# EAGLE design Adafruit STEMMA QT Booster Breakout (EAGLE 9.6.2)
COMPANY: ADAFRUIT INDUSTRIES; DRAWN: KTOWN; REV: A
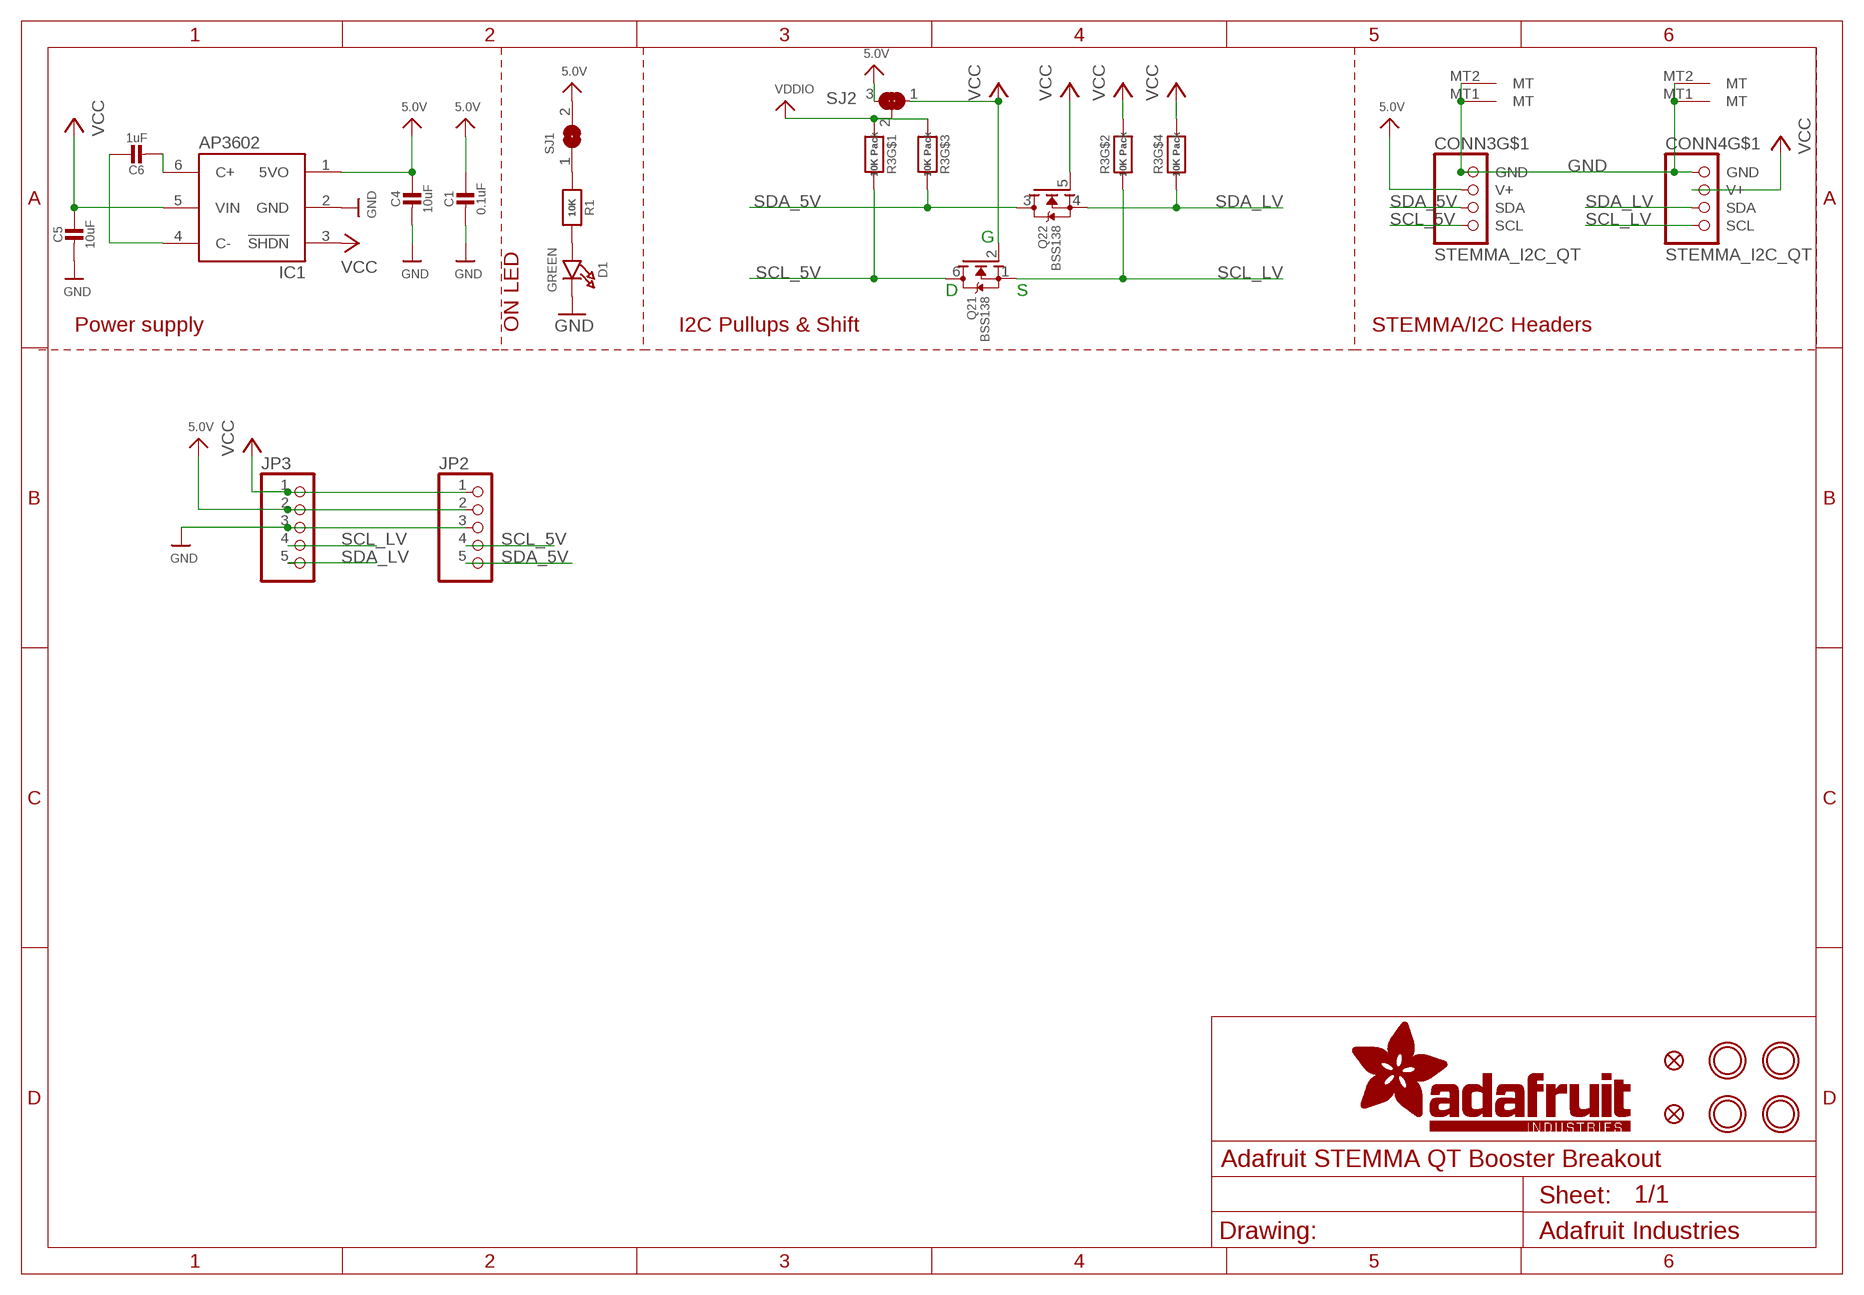
[diagram p0: schematic, sheet 1]

## Parts
C1  0.1uF  CAP_CERAMIC0603_NO  [0603-NO]
C4  10uF  CAP_CERAMIC0805-NOOUTLINE  [0805-NO]
C5  10uF  CAP_CERAMIC0805-NOOUTLINE  [0805-NO]
C6  1uF  CAP_CERAMIC0805-NOOUTLINE  [0805-NO]
CONN3  STEMMA_I2C_QT  [JST_SH4]
CONN4  STEMMA_I2C_QT  [JST_SH4]
D1  GREEN  LED0603_NOOUTLINE  [CHIPLED_0603_NOOUTLINE]
FID3  FIDUCIAL_1MM  [FIDUCIAL_1MM]
FID4  FIDUCIAL_1MM  [FIDUCIAL_1MM]
IC1  AP3602/RT9361  AP3602  [SOT23-6]
JP2  HEADER-1X576MIL  [1X05_ROUND_76]
JP3  HEADER-1X576MIL  [1X05_ROUND_76]
Q2  BSS138  MOSFET-N_DUAL  [SOT363]
R1  10K  RESISTOR_0603_NOOUT  [0603-NO]
R3  10K Pack  RESISTOR_4PACK  [RESPACK_4X0603]
SJ1  SOLDERJUMPERCLOSED  [SOLDERJUMPER_CLOSEDWIRE]
SJ2  SOLDERJUMPER_2WAY  [SOLDERJUMPER_2WAY_OPEN_NOPASTE]
U$1  MOUNTINGHOLE2.5  [MOUNTINGHOLE_2.5_PLATED]
U$17  MOUNTINGHOLE2.5  [MOUNTINGHOLE_2.5_PLATED]
U$19  MOUNTINGHOLE2.5  [MOUNTINGHOLE_2.5_PLATED]
U$21  MOUNTINGHOLE2.5  [MOUNTINGHOLE_2.5_PLATED]

## Nets
5.0V: C1.1 C4.1 CONN3.2(V+) IC1.1(5VO) JP2.2 JP3.2 SJ1.2 SJ2.3
GND [highpower]: C1.2 C4.2 C5.2 CONN3.1(GND) CONN3.MT1(MT) CONN3.MT2(MT) CONN4.1(GND) CONN4.MT1(MT) CONN4.MT2(MT) D1.C IC1.2(GND) JP2.3 JP3.3
N$1: D1.A R1.2
N$2 [lowpower]: R1.1 SJ1.1
N$3: C6.2 IC1.6(C+)
N$4: C6.1 IC1.4(C-)
SCL_5V: CONN3.4(SCL) JP2.4 Q2.6(1:D) R3.8
SCL_LV: CONN4.4(SCL) JP3.4 Q2.1(1:S) R3.7
SDA_5V: CONN3.3(SDA) JP2.5 Q2.3(2:D) R3.6
SDA_LV: CONN4.3(SDA) JP3.5 Q2.4(2:S) R3.5
VCC [highpower]: C5.1 CONN4.2(V+) IC1.3(!SHDN) IC1.5(VIN) JP2.1 JP3.1 Q2.2(1:G) Q2.5(2:G) R3.2 R3.4 SJ2.1
VDDIO: R3.1 R3.3 SJ2.2

## Notes on the sheet
- G
- D | S
- Power supply | ON LED | I2C Pullups & Shift | STEMMA/I2C Headers

## Library data of the parts
C1 C4-C6 = microbuilder:CAP_CERAMIC: Ceramic Capacitors For new designs, use the packages preceded by an '_' character since they are more reliable: The following footprints should be used on most boards: _0402 - Standard footprint for regular board layouts _0603 - Standard footprint for regular board layouts _0805 - Standard footprint for regular board layouts _1206 - Standard footprint for regular board layouts For extremely tight-pitch boards where space is at a premium, the following 'micro-pitch' footprints can be used (smaller pads, no silkscreen outline, etc.): _0402MP - Micro-pitch footprint for very dense/compact boards _0603MP - Micro-pitch footprint for very dense/compact boards _0805MP - Micro-pitch footprint for very dense/compact boards _1206MP - Micro-pitch footprint for very dense/compact boards
CONN3 CONN4 = adafruit_electromech:STEMMA_I2C; LCSC: C2845363
D1 = microbuilder:LED: LED 0603 - 0603 Surface Mount Package 2mA: Green LED - Low Power (3.9mcd, 2ma, 1.7Vf) - Digikey: 475-2709-2-ND Orange LED - Low Power (9.8mcd, 2ma, 1.8Vf) - Digikey: 475-1194-2-ND Red LED - Low Power (5mcd, 2ma, 1.8Vf) - Digikey: 475-1195-2-ND Yellow LED - Low Power (7mcd, 2ma, 1.8Vf) - Digikey: 475-1196-2-ND 5mA: Blue LED - Low Power (17mcd, 5ma, 2.9Vf) - Digikey: LNJ937W8CRACT-ND 0805 - 0805 Surface Mount Package 2mA: Red LED (8.8mcd, 2mA, 1.8Vf, Clear) - Low Power [Digikey: 475-2510-1-ND] Green LED (5mcd, 2mA, 1.8Vf, Clear) - Low Power [Digikey: 475-2730-1-ND] Yellow LED (11.3mcd, 2mA, 1.8Vf, Clear) - Low Power [Digikey: 475-2555-1-ND] 20mA: Red LED (104mcd, 20mA, Diffused) - LS R976 [Digikey: 475-1278-6-ND] Red LED (12mcd, 20mA, 2.0Vf, Clear) - APT2012EC [Digikey: 754-1128-1-ND] Green LED (15mcd, 20mA, 2.2Vf, Clear) - APT2012GC [Digikey: 754-1131-1-ND] Orange LED (160mcd, 20mA, 2.1Vf, Clear) - APT2012SECK [Digikey: 754-1130-1-ND] 1206 - 1206 Surface Mount Package Green LED (26mcd, 20mA, Diffused) - LG N971 [Digikey: 475-1407-6-ND] Red LED (15mcd, 20mA, Diffused) - LH N974 [Digikey: 475-1416-6-ND] Cree - Cree High-Power Surface Mount LEDs XPEBWT-L1-0000-00D50 - White 111lm 350mA 2.9Vf 6200K 110° XTEAWT-00-0000-00000LEE3 - White 114lm 350mA 2.85Vf 5000K 115° Everlight - Everlight 45-21 Series Surface Mount LEDs 45-21/QK2C-B2832AC2CB2/2T - Warm White 2000mcd 20mA 3.25Vf 3050K 120° 45-21/LK2C-B38452C4CB2/2T - Nuetral White 2000mcd 20mA 3.25Vf 4150K 120° 45-21/LK2C-B50634C6CB2/2T - Cold White 2200mcd 20mA 3.25Vf 5650K 120° PLCC2 Reverse Mount LS T77K-J1L2-1-0-2-R18-Z - Red 11.25mcd 2mA 1.8Vf 630nm 120° LO T77K-L1M2-24-Z - Orange 19.6mcd 2mA 1.8Vf 606nm 120° LY T77K-K2M1-26-Z - Yellow 15.7mcd 2mA 1.8Vf 587nm 120°; ROT: 270
FID3 FID4 = microbuilder:FIDUCIAL: Fiducial Alignment Points Various fiducial points for machine vision alignment.; BOM: EXCLUDE
IC1 = microbuilder:AP3602
JP2 JP3 = microbuilder:HEADER-1X5: PIN HEADER
Q2 = microbuilder:MOSFET-N_DUAL: Dual N-Channel MOSFET SOT363 (2.0x1.25mm) 2N7002PS - 60V, 320mA [Digikey: 568-5984-1-ND]; JLC_ROTATION: 270
R1 = microbuilder:RESISTOR: Resistors For new designs, use the packages preceded by an '_' character since they are more reliable: The following footprints should be used on most boards: _0402 - Standard footprint for regular board layouts _0603 - Standard footprint for regular board layouts _0805 - Standard footprint for regular board layouts _1206 - Standard footprint for regular board layouts For extremely tight-pitch boards where space is at a premium, the following 'micro-pitch' footprints can be used (smaller pads, no silkscreen outline, etc.): _0402MP - Micro-pitch footprint for very dense/compact boards _0603MP - Micro-pitch footprint for very dense/compact boards _0805MP - Micro-pitch footprint for very dense/compact boards _1206MP - Micro-pitch footprint for very dense/compact boards
R3 = microbuilder:RESISTOR_4PACK: Resistor Packs (4 resistors) 4 x 0603 10K 1/16W - Digikey: YC164J-10KCT-ND
SJ1 = microbuilder:SOLDERJUMPER: SMD Solder JUMPER Solder the two pads together to create a connection, or remove the solder to break it. REFLOW - Use this footprint for solder paste and reflow ovens. WAVE - Use this footprint for hand-soldering (larger pads). CLOSED - Has a trace between the two pads to ensure it is closed by default. The trace needs to be cut to disable the jumper, and can be closed again by creating a solder bridge between the two pads.
SJ2 = microbuilder:SOLDERJUMPER_2WAY: 2-Way Solder Jumper
U$1 U$17 U$19 U$21 = adafruit_electromech:MOUNTINGHOLE: Mounting Hole For #2 screws (0.086"/2.18mm width, 0.094"/2.4mm hole) use 2.5mm; BOM: EXCLUDE

## Net classes
1 highpower: width 0.305 mm, drill 0.483 mm
2 lowpower: width 0.254 mm, drill 0.483 mm

## Board
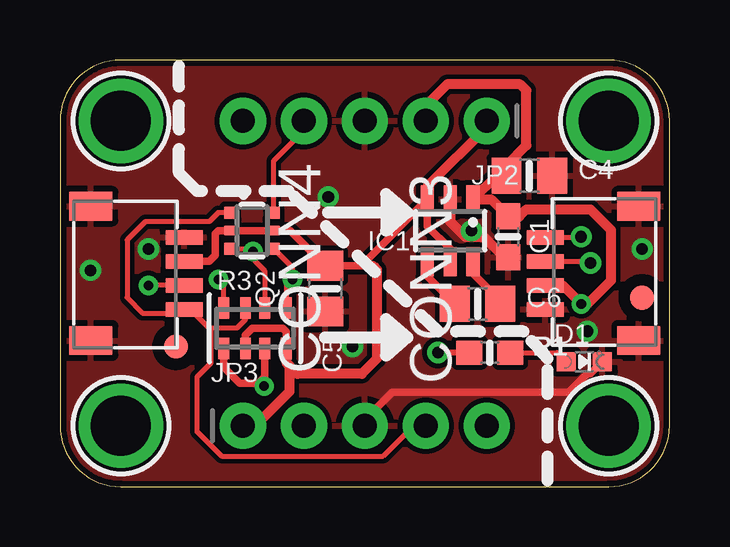
[diagram p1: board, top side]
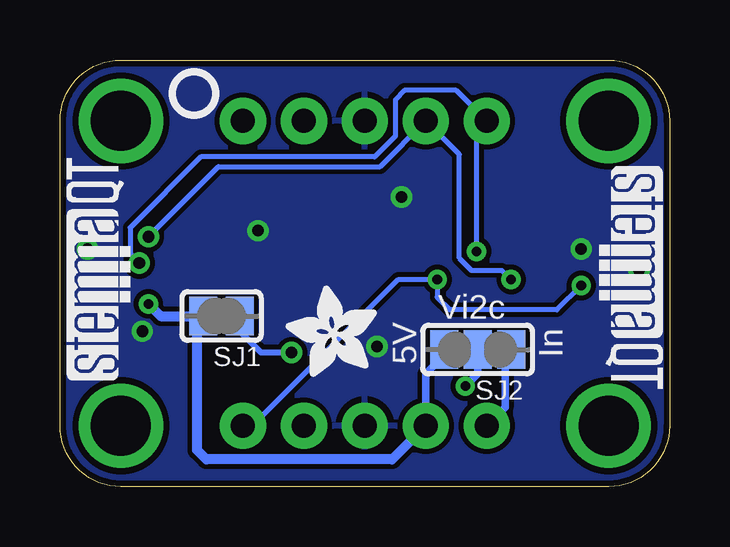
[diagram p2: board, bottom side, seen from below]

Size 25.4 x 17.78 mm. Coordinates in mm from the lower left corner, seen from the top.
Outline: 25.4,2.54 25.4,15.24 arc90 22.86,17.78 2.54,17.78 arc90 0,15.24 0,2.54 arc90 2.54,0 22.86,0 arc90 25.4,2.54
Copper layers (1*16): Top 0.035mm / dielectric 1.5mm / Bottom 0.035mm
Design rules "adafruit *": minimum track width 8mil, minimum drill 15.5mil, track to track 8mil, track to pad 8mil, pad to pad 8mil, via to via 8mil, smd to smd 8mil, copper to edge 10mil, drill to drill 8mil, minimum pad ring 10mil, minimum via ring 8mil, stop-mask expansion 2mil, vias tented up to drill 20mil, thermal gap 10mil

### Footprints (pad centres in the part's own frame; a part is rotated, then mirrored left to right if it is on the bottom)
0603-NO = smd 1.075 x 1: 1 -0.85,0; 2 0.85,0
0805-NO = smd 1.24 x 1.5: 1 -0.95,0; 2 0.95,0
JST_SH4 = smd 0.6 x 1.55: 1 -1.5,2.006; 2 -0.5,2.006; 3 0.5,2.006; 4 1.5,2.006 | smd 1.2 x 1.8: MT1 -2.8,-1.894; MT2 2.8,-1.894
CHIPLED_0603_NOOUTLINE = smd 0.8 x 0.8: A 0,-0.75; C 0,0.75
FIDUCIAL_1MM = smd 1 x 1: 1 0,0
SOT23-6 = smd 0.55 x 1.2: 1 -0.95,-1.3; 2 0,-1.3; 3 0.95,-1.3; 4 0.95,1.3; 5 0,1.3; 6 -0.95,1.3
1X05_ROUND_76 = drill 1 pad 1.93: 1 -5.08,0; 2 -2.54,0; 3 0,0; 4 2.54,0; 5 5.08,0
SOT363 = smd 0.5 x 0.5: 1 -0.75,-0.9; 3 0.75,-0.9; 4 0.75,0.9; 6 -0.75,0.9 | smd 0.4 x 0.5: 2 0,-0.9; 5 0,0.9
RESPACK_4X0603 = smd 0.45 x 0.9: 1 -1.3,-0.85; 2 -0.4,-0.85; 3 0.4,-0.85; 4 1.3,-0.85; 5 1.3,0.85; 6 0.4,0.85; 7 -0.4,0.85; 8 -1.3,0.85
SOLDERJUMPER_CLOSEDWIRE = smd 1.168 x 1.6: 1 -0.762,0; 2 0.762,0 | smd 0.635 x 0.203: WIRE 0,0
SOLDERJUMPER_2WAY_OPEN_NOPASTE = smd 1.168 x 1.6: 1 -1.397,0; 2 0,0; 3 1.397,0
MOUNTINGHOLE_2.5_PLATED = drill 2.5 pad 3.2: P$1 0,0

### Placement (x,y rotation side)
C1  18.67,10.41 270 top
C4  19.56,12.95 0 top
C5  11.05,8.26 270 top
C6  17.4,7.62 0 top
CONN3  22.23,8.89 90 top
CONN4  3.17,8.89 270 top
D1  21.84,5.21 270 top
FID3  4.83,5.84 180 top
FID4  24.26,7.87 180 top
IC1  16.26,10.67 180 top
JP2  12.7,15.24 180 top
JP3  12.7,2.54 0 top
PLABEL0  [PLABEL0]  17.91,16.89 0 top
PLABEL1  [PLABEL1]  15.24,16.89 0 top
PLABEL2  [PLABEL2]  12.57,16.89 0 top
PLABEL3  [PLABEL3]  10.16,16.89 0 top
PLABEL4  [PLABEL4]  7.37,16.89 0 top
PLABEL5  [PLABEL5]  23.62,4.57 0 top
PLABEL6  [PLABEL6]  7.24,0.76 0 top
PLABEL7  [PLABEL7]  10.16,0.76 0 top
PLABEL8  [PLABEL8]  12.83,0.76 0 top
PLABEL9  [PLABEL9]  15.37,0.76 0 top
PLABEL10  [PLABEL10]  18.41,0.76 0 top
PLABEL11  [PLABEL11]  12.7,13.34 0 top
PLABEL12  [PLABEL12]  12.45,4.45 0 top
PLABEL13  [PLABEL13]  18.8,5.21 0 bottom
PLABEL14  [PLABEL14]  12.7,11.05 0 bottom
Q2  8,10.67 270 top
R1  17.91,5.59 0 top
R3  8.13,6.6 0 top
SJ1  18.67,7.11 180 bottom
SJ2  8,5.71 180 bottom
U$1  22.86,2.54 180 top
U$2  [ADAFRUIT_3.5MM]  12.19,4.57 90 bottom
U$17  2.54,2.54 180 top
U$19  22.86,15.24 180 top
U$21  2.54,15.24 180 top
U$25  [PCBFEAT-REV-040]  19.81,16.38 180 bottom
U$30  [STEMMAQT]  2.92,13.34 270 bottom
U$31  [STEMMAQT]  22.48,4.45 90 bottom

### Tracks (layer width: path | path; a pad name or v marks a point on that pad's centre or on a via)
5.0V  (via drill 0.4)
  Top 0.406: JP2.2 15.24,15.88 16.13,16.76 19.18,16.76 19.43,16.51 19.43,14.22 18.61,13.4 C4.1 18.19,12.95 IC1.1 17.96,11.97 C1.1 19.14,11.26 19.43,11.56 22.1,11.56 22.95,10.71 22.95,8.59 21.98,7.62 v21.72,7.62 20.95,8.39 CONN3.2
  Bottom 0.305: SJ2.3 9.4,5.46 10.16,4.7 JP3.2
  Bottom 0.406: JP3.2 11.56,1.14 19.3,1.14 19.68,1.52 19.68,7.11 SJ1.2 21.21,7.11 v21.72,7.62
GND  (via drill 0.48)
  Top 0.305: D1.C 22.09,4.71 21.96,4.71 21.19,3.94 13.84,3.94 12.7,2.79 JP3.3
  Top 0.406: IC1.2 16.26,11.05 16.89,10.41 17.65,10.41 18.5,9.56 C1.2
  other vias: 3.68,9.91 1.27,9.02 24.26,9.91 21.97,6.48 12.19,5.84 17.14,10.67 11.18,12.06
  pour Top: 25.4,0 0,0 0,17.78 25.4,17.78
  pour Bottom: 25.4,0 0,0 0,17.78 25.4,17.78
N$1
  Top 0.203: R1.2 20.71,5.59 D1.A
N$2  (via drill 0.48)
  Top 0.254: R1.1 v15.75,5.59
  Bottom 0.254: v15.75,5.59 17.02,5.59 17.91,6.48 SJ1.1
N$3
  Top 0.305: C6.2 18.35,7.75 17.21,8.89 IC1.6
N$4
  Top 0.305: IC1.4 15.31,8.76 C6.1
N$5
  Bottom 0.203: 8.51,5.71 8.89,5.71
SCL_5V  (via drill 0.4, 0.48)
  Top 0.203: R3.8 6.83,8.41 v6.6,8.64 | Q2.6 8.9,13.58 10.16,14.84 JP2.4 | CONN3.4 21.69,10.39 v21.72,10.41
  Bottom 0.203: v6.6,8.64 6.99,9.02 8.26,9.02 8.76,9.53 8.76,13.84 JP2.4 12.06,13.34 18.8,13.34 v21.72,10.41
SCL_LV
  Top 0.203: R3.7 7.73,6.97 7.37,6.6 6.35,6.6 | 5.33,7.24 CONN4.4 | Q2.1 6.59,11.42 6.22,11.05 3.56,11.05 2.79,10.29 2.79,7.87 3.43,7.24 5.21,7.24 5.33,7.24 | 5.33,7.24 5.59,7.24 6.22,6.6 6.35,6.6 | JP3.4 14.73,2.54 13.46,1.27 6.73,1.27 5.71,2.29 5.71,4.57 6.3,5.16 6.3,6.55 6.35,6.6
SDA_5V  (via drill 0.4, 0.48)
  Top 0.203: R3.6 8.53,9 8.13,9.4 8.13,9.72 | Q2.3 7.99,9.92 8.13,9.78 8.13,9.72 | CONN3.3 22.03,9.39 v22.1,9.32 | v8.04,9.81 8.13,9.72
  Bottom 0.203: v22.1,9.32 22.48,9.7 22.48,10.79 19.53,13.74 12.29,13.74 11.43,14.61 11.43,16.13 11.05,16.51 8.89,16.51 JP2.5 8.04,14.81 v8.04,9.81
SDA_LV  (via drill 0.4)
  Top 0.203: Q2.4 9.68,9.14 v9.68,8.64 9.59,8.64 9.43,8.47 R3.5 | CONN4.3 3.69,8.39 v3.68,8.38
  Bottom 0.203: v3.68,8.38 4.7,7.37 9.14,7.37 9.68,7.9 v9.68,8.64 11.3,8.64 17.4,2.54 JP3.5
VCC
  Top 0.305: CONN4.2 6.21,9.39 6.47,9.64 6.47,10.54 6.59,10.67 Q2.2 Q2.5 9.59,10.67 C5.1 12.54,9.21 | 7.73,2.65 JP3.1 | R3.2 7.73,6.32 8.01,6.6 9.27,6.6 9.43,6.45 R3.4 | IC1.5 16.26,9.91 15.31,10.86 IC1.3 12.54,9.21 | 12.54,9.21 13.05,9.21
  Top 0.406: JP2.1 17.78,14.99 15.31,12.51 IC1.3 | 13.05,9.21 13.21,9.05 13.21,5.33 12.57,4.7 9.91,4.7 9.55,5.05 | 9.55,5.05 9.43,5.18 R3.4 | 9.55,5.05 9.55,3.97 8.24,2.65 7.73,2.65
  Bottom 0.305: JP3.1 6.86,3.3 6.86,5.46 SJ2.1
VDDIO  (via drill 0.39)
  Top 0.305: R3.1 6.83,4.98 7.49,4.32 8.26,4.32 | 8.26,4.32 8.53,4.59 R3.3 | v8.51,4.19 8.38,4.32 8.26,4.32
  Bottom 0.305: v8.51,4.19 8,4.7 SJ2.2

### Text on the board
bPlace: In | Vi2c | 5V
Pinguin_tBackup: 5DL | 5CL | G | 5V | VIN | 5V logic level | on | 3-5V logic level | VIN | 5V | G | 3CL | 3DA
Pinguin_bBackup: Stemma QT/Breadboard / 5V Boost + Level Shifter / 3-5V in, 5V@100mA Out | LED